# EAGLE design WalkSensor_V2.1 (EAGLE 9.3.0)
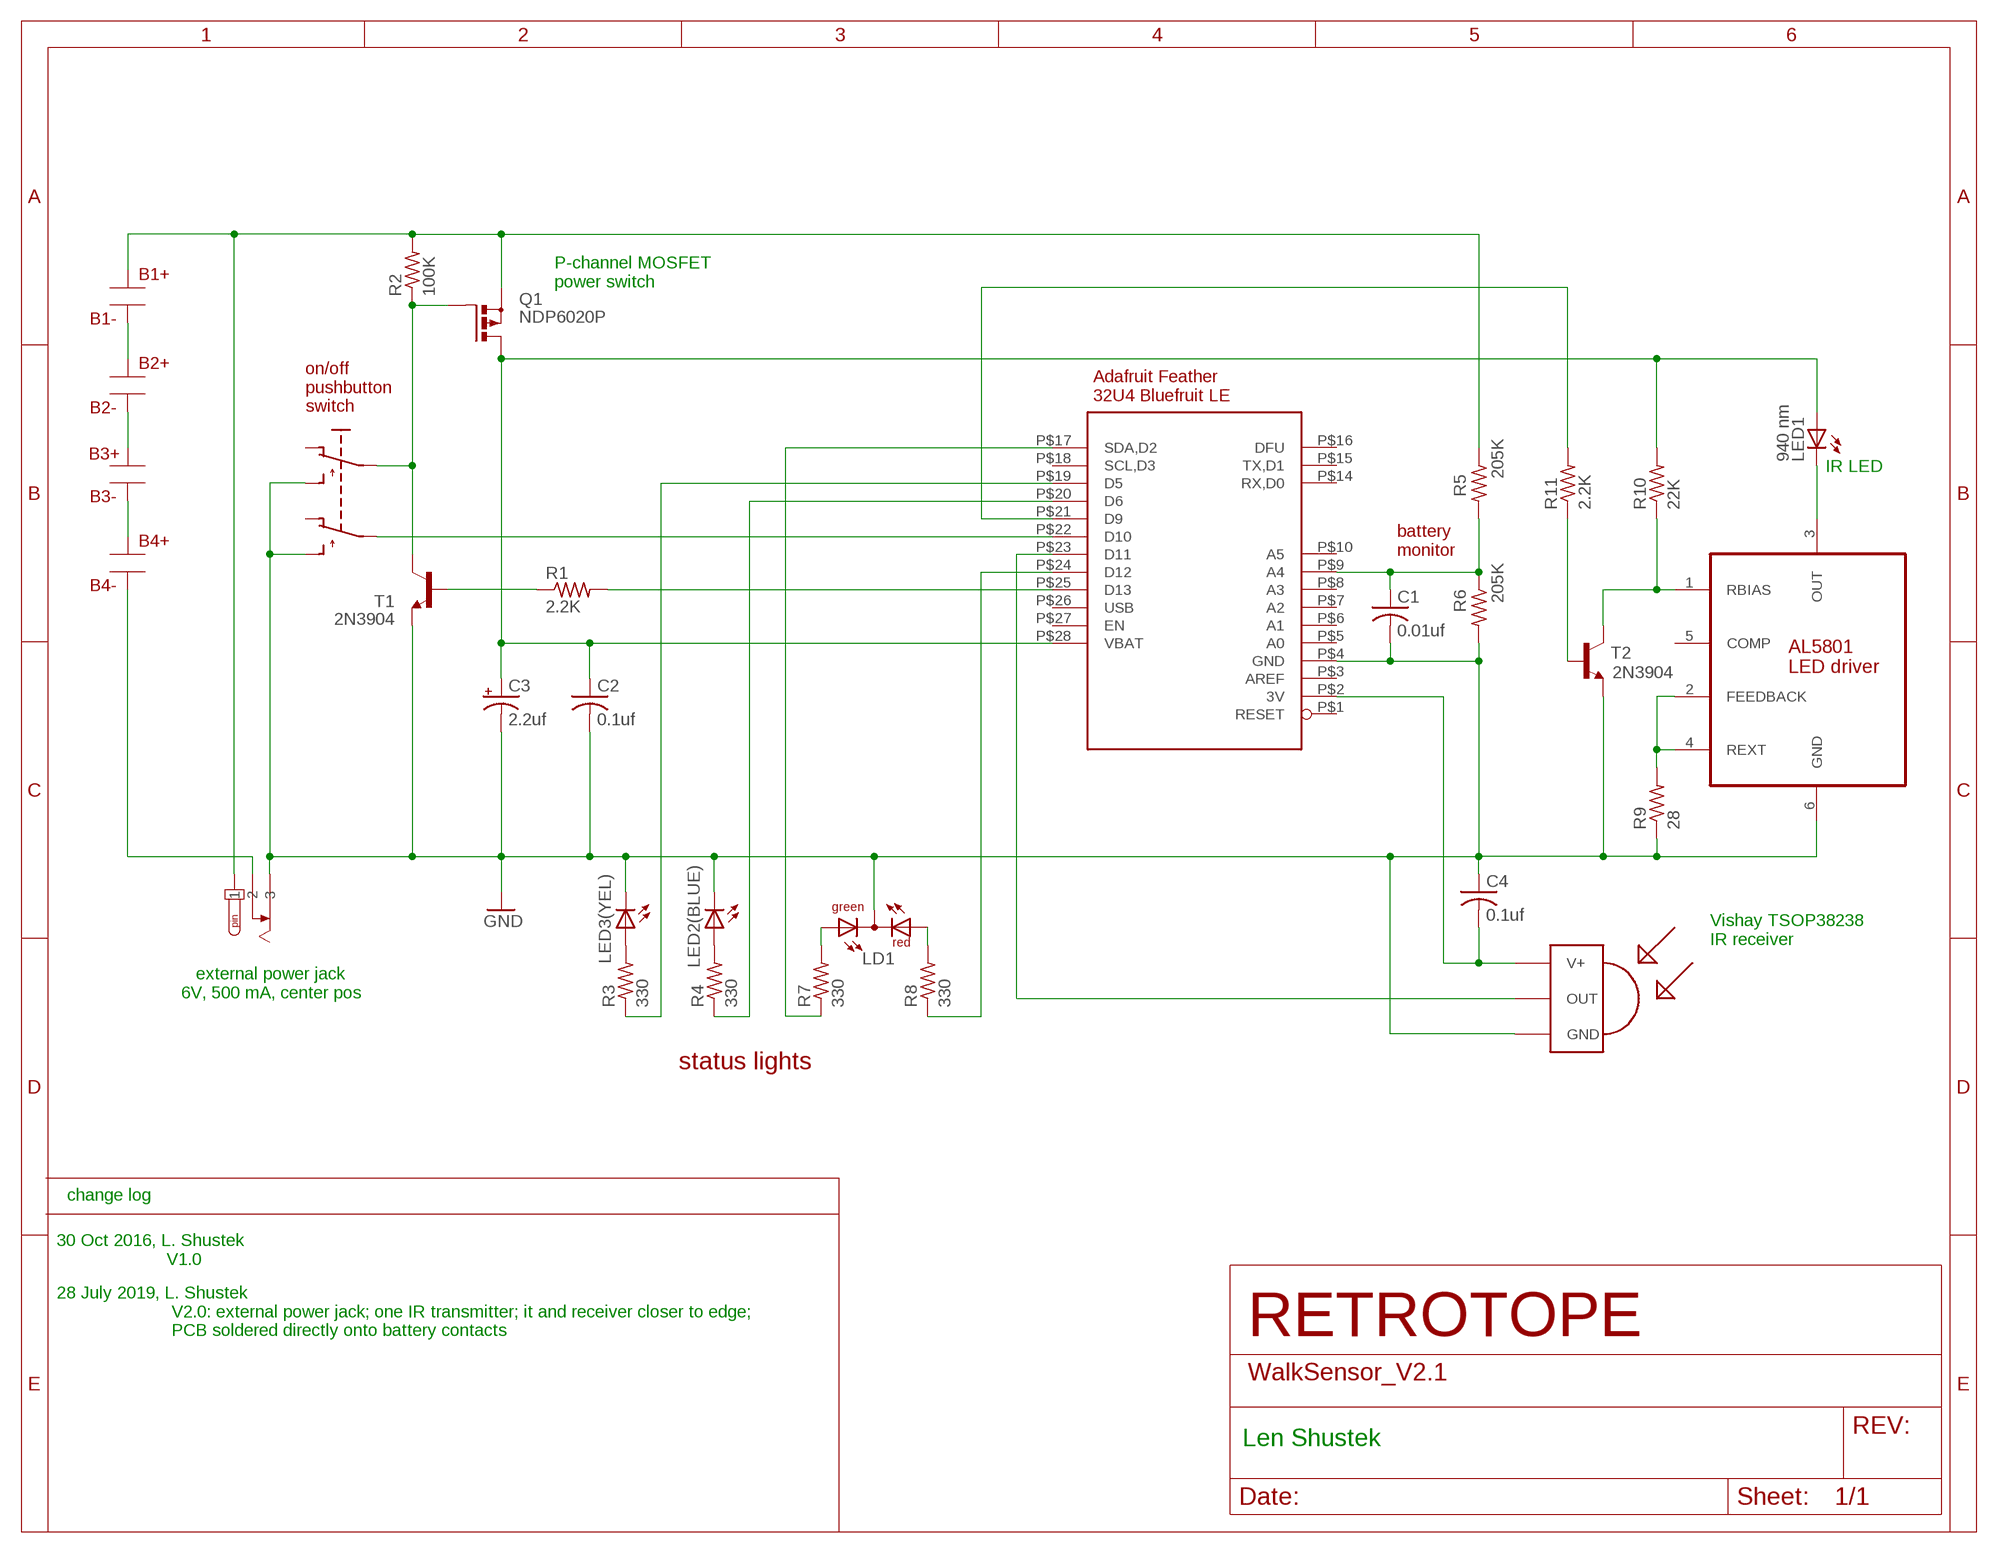
[diagram p0: schematic, sheet 1]

## Parts
B1+  BATTERY_CONTACT  [BATTERY_CONTACT]
B1-  BATTERY_CONTACT  [BATTERY_CONTACT]
B2+  BATTERY_CONTACT  [BATTERY_CONTACT]
B2-  BATTERY_CONTACT  [BATTERY_CONTACT]
B3+  BATTERY_CONTACT  [BATTERY_CONTACT]
B3-  BATTERY_CONTACT  [BATTERY_CONTACT]
B4+  BATTERY_CONTACT  [BATTERY_CONTACT]
B4-  BATTERY_CONTACT  [BATTERY_CONTACT]
C1  0.01uf  C-US025-025X050  [C025-025X050]
C2  0.1uf  C-US025-025X050  [C025-025X050]
C3  2.2uf  CPOL-USE5-6  [E5-6]
C4  0.1uf  C-US025-025X050  [C025-025X050]
J1  DC_POWER_JACK  [DC_POWER_JACK]
LD1  red/green  DUOLED-RG-C  [DUOLED-C-5MM]
LED1  940 nm  LED3MM  [LED3MM]
LED2(BLUE)  blue  LED5MM  [LED5MM]
LED3(YEL)  yellow  LED5MM  [LED5MM]
Q1  NDP6020P  PMOSFET_PTO220BH  [TO220BH]
R1  2.2K  R-US_0207/10  [0207/10]
R2  100K  R-US_0207/10  [0207/10]
R3  330  R-US_0207/10  [0207/10]
R4  330  R-US_0207/10  [0207/10]
R5  205K  R-US_0207/10  [0207/10]
R6  205K  R-US_0207/10  [0207/10]
R7  330  R-US_0207/10  [0207/10]
R8  330  R-US_0207/10  [0207/10]
R9  28  R-US_0207/10  [0207/10]
R10  22K  R-US_0207/10  [0207/10]
R11  2.2K  R-US_0207/10  [0207/10]
T1  2N3904  NPN-TRANSISTOR  [TO92-EBC]
T2  2N3904  NPN-TRANSISTOR  [TO92-EBC]
U1  AL5801  [SOT95P280X130-6N]
U$2  PUSHBUTTON-DPDT  [PUSHBUTTON-DPDT]
U$3  TSOP1830  [TSOP18XX]
U$4  BLUEFRUIT-LE  [BLUEFRUIT-LE]

## Nets
3V [power]: C4.2 U$3.VCC(V+) U$4.P$2(3V)
GND [power]: C1.2 C2.2 C3.- C4.1 J1.P$5 LD1.C LED2(BLUE).K(C) LED3(YEL).K(C) R6.2 R9.1 T1.E T2.E U1.6(GND) U$2.P$1(S) U$2.P$2(S1) U$3.GND U$4.P$4(GND)
N$1: U$2.P$6(P1) U$4.P$22(D10)
N$2: LED3(YEL).A R3.2
N$3 [power]: B1+.P$1 J1.P$1 Q1.S R2.2 R5.1
N$4: LED2(BLUE).A R4.2
N$5: Q1.G R2.1 T1.C U$2.P$5(P)
N$6: R11.1 T2.B
N$7: R1.2 U$4.P$25(D13)
N$8: R1.1 T1.B
N$9: R4.1 U$4.P$20(D6)
N$10: R3.1 U$4.P$19(D5)
N$11 [low power]: LED1.K(C) U1.3(OUT)
N$12: R11.2 U$4.P$21(D9)
N$13: LD1.AG R7.2
N$14: LD1.AR R8.2
N$15 [power]: B1-.P$1 B2+.P$1
N$16: R7.1 U$4.P$17(SDA,D2)
N$17 [power]: B2-.P$1 B3+.P$1
N$18: U$3.OUT U$4.P$23(D11)
N$19: R9.2 U1.2(FEEDBACK) U1.4(REXT)
N$20: C1.1 R5.2 R6.1 U$4.P$9(A4)
N$21: R10.1 T2.C U1.1(RBIAS)
N$22: R8.1 U$4.P$24(D12)
N$23 [power]: B3-.P$1 B4+.P$1
N$24 [power]: B4-.P$1 J1.P$3
VBAT [power]: C2.1 C3.+ LED1.A Q1.D R10.2 U$4.P$28(VBAT)
Unconnected: U1.5(COMP) U$2.P$3(O) U$2.P$4(O1) U$4.P$1(RESET) U$4.P$3(AREF) U$4.P$5(A0) U$4.P$6(A1) U$4.P$7(A2) U$4.P$8(A3) U$4.P$10(A5) U$4.P$14(RX,D0) U$4.P$15(TX,D1) U$4.P$16(DFU) U$4.P$18(SCL,D3) U$4.P$26(USB) U$4.P$27(EN)

## Notes on the sheet
- P-channel MOSFET
  power switch
- Adafruit Feather
  32U4 Bluefruit LE
- on/off
  pushbutton
  switch
- IR LED
- battery
  monitor
- Vishay TSOP38238
  IR receiver
- external power jack
  6V, 500 mA, center pos
- status lights
- change log
- 30 Oct 2016, L. Shustek
                        V1.0
- 28 July 2019, L. Shustek
                         V2.0: external power jack; one IR transmitter; it and receiver closer to edge;
                         PCB soldered directly onto battery contacts
- RETROTOPE
- Len Shustek

## Library data of the parts
B1+ B1- B2+ B2- B3+ B3- B4+ B4- = Len:BATTERY_CONTACT
C1 C2 C4 = resistor:C-US: CAPACITOR, American symbol
C3 = resistor:CPOL-US: POLARIZED CAPACITOR, American symbol
J1 = Len:DC_POWER_JACK: DC POWER JACK Source: DCJ0202.pdf; OC_FARNELL: unknown; OC_NEWARK: unknown
LD1 = Len:DUOLED-RG-C: DUO LED 2 colors (red/green), 5 mm, round, common Cathode www.ligitek.com or other producers.
LED1 = adafruit:LED: LED OSRAM: - CHIPLED LG R971, LG N971, LY N971, LG Q971, LY Q971, LO R971, LY R971 LH N974, LH R974 LS Q976, LO Q976, LY Q976 LO Q996 - Hyper CHIPLED LW Q18S LB Q993, LB Q99A, LB R99A - SideLED LS A670, LO A670, LY A670, LG A670, LP A670 LB A673, LV A673, LT A673, LW A673 LH A674 LY A675 LS A676, LA A676, LO A676, LY A676, LW A676 LS A679, LY A679, LG A679 - Hyper Micro SIDELED® LS Y876, LA Y876, LO Y876, LY Y876 LT Y87S - SmartLED LW L88C, LW L88S LB L89C, LB L89S, LG L890 LS L89K, LO L89K, LY L89K LS L896, LA L896, LO L896, LY L896 - TOPLED LS T670, LO T670, LY T670, LG T670, LP T670 LSG T670, LSP T670, LSY T670, LOP T670, LYG T670 LG T671, LOG T671, LSG T671 LB T673, LV T673, LT T673, LW T673 LH T674 LS T676, LA T676, LO T676, LY T676, LB T676, LH T676, LSB T676, LW T676 LB T67C, LV T67C, LT T67C, LS T67K, LO T67K, LY T67K, LW E67C LS E67B, LA E67B, LO E67B, LY E67B, LB E67C, LV E67C, LT E67C LW T67C LS T679, LY T679, LG T679 LS T770, LO T770, LY T770, LG T770, LP T770 LB T773, LV T773, LT T773, LW T773 LH T774 LS E675, LA E675, LY E675, LS T675 LS T776, LA T776, LO T776, LY T776, LB T776 LHGB T686 LT T68C, LB T68C - Hyper Mini TOPLED® LB M676 - Mini TOPLED Santana® LG M470 LS M47K, LO M47K, LY M47K Source: http://www.osram.convergy.de/
LED2(BLUE) LED3(YEL) = Len:LED: LED OSRAM: - CHIPLED LG R971, LG N971, LY N971, LG Q971, LY Q971, LO R971, LY R971 LH N974, LH R974 LS Q976, LO Q976, LY Q976 LO Q996 - Hyper CHIPLED LW Q18S LB Q993, LB Q99A, LB R99A - SideLED LS A670, LO A670, LY A670, LG A670, LP A670 LB A673, LV A673, LT A673, LW A673 LH A674 LY A675 LS A676, LA A676, LO A676, LY A676, LW A676 LS A679, LY A679, LG A679 - Hyper Micro SIDELED® LS Y876, LA Y876, LO Y876, LY Y876 LT Y87S - SmartLED LW L88C, LW L88S LB L89C, LB L89S, LG L890 LS L89K, LO L89K, LY L89K LS L896, LA L896, LO L896, LY L896 - TOPLED LS T670, LO T670, LY T670, LG T670, LP T670 LSG T670, LSP T670, LSY T670, LOP T670, LYG T670 LG T671, LOG T671, LSG T671 LB T673, LV T673, LT T673, LW T673 LH T674 LS T676, LA T676, LO T676, LY T676, LB T676, LH T676, LSB T676, LW T676 LB T67C, LV T67C, LT T67C, LS T67K, LO T67K, LY T67K, LW E67C LS E67B, LA E67B, LO E67B, LY E67B, LB E67C, LV E67C, LT E67C LW T67C LS T679, LY T679, LG T679 LS T770, LO T770, LY T770, LG T770, LP T770 LB T773, LV T773, LT T773, LW T773 LH T774 LS E675, LA E675, LY E675, LS T675 LS T776, LA T776, LO T776, LY T776, LB T776 LHGB T686 LT T68C, LB T68C - Hyper Mini TOPLED® LB M676 - Mini TOPLED Santana® LG M470 LS M47K, LO M47K, LY M47K Source: http://www.osram.convergy.de/
Q1 = transistor-power:PMOSFET_P: Power MOSFET P-Channel
R1-R11 = resistor:R-US_: RESISTOR, American symbol
T1 T2 = Len:NPN-TRANSISTOR
U1 = Len:AL5801: 25V 10A GATE DRIVER IN SOT26; MPN: ZXGD3005E6TA; OC_FARNELL: 1904033; OC_NEWARK: 55T4050; PACKAGE: SOT-26-6; SUPPLIER: DIODES INC.
U$2 = Len:PUSHBUTTON-DPDT
U$3 = tsop:TSOP1830: IR Receiver and Demodulator
U$4 = Len:BLUEFRUIT-LE

## Net classes
1 power: width 1.27 mm
2 ground: width 1.27 mm
3 low power: width 0.559 mm

## Board
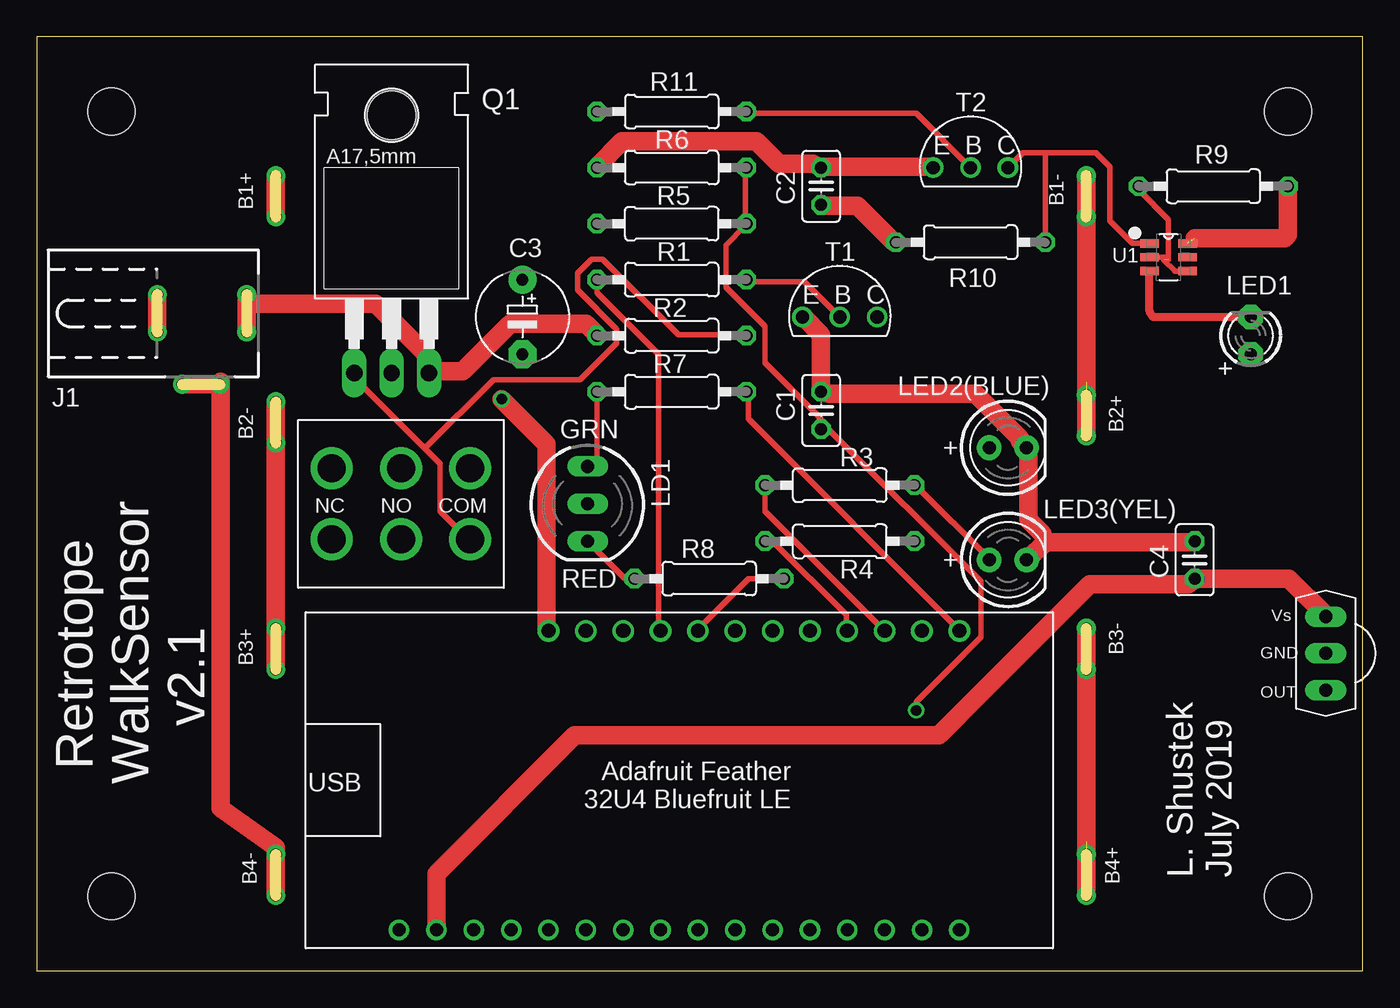
[diagram p1: board, top side]
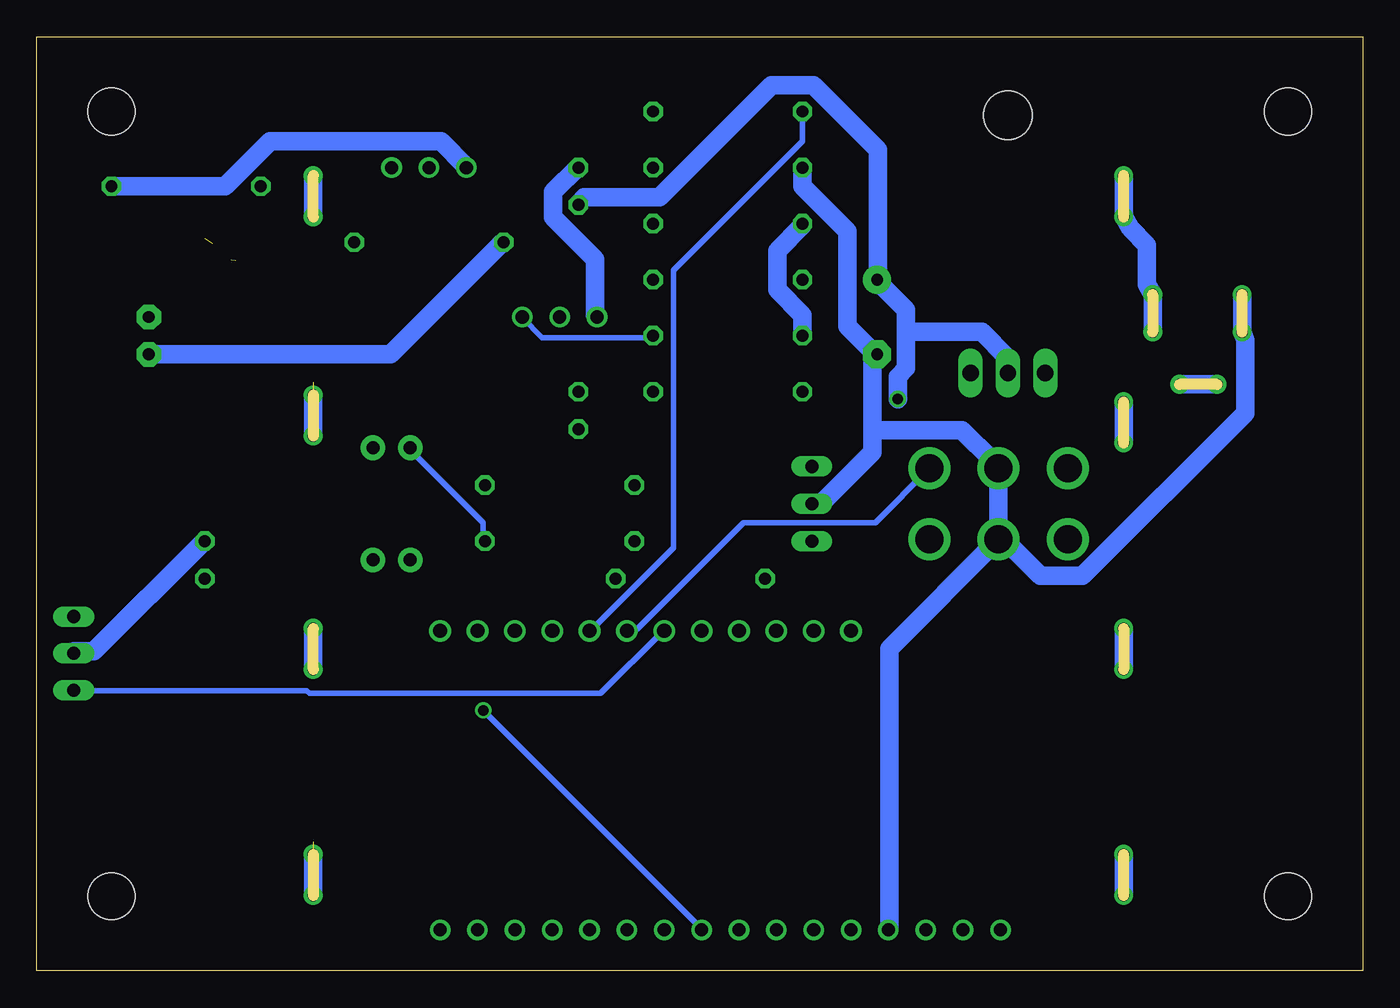
[diagram p2: board, bottom side, seen from below]

Size 90.17 x 63.5 mm. Coordinates in mm from the lower left corner, seen from the top.
Outline: 0,0 90.17,0 90.17,63.5 0,63.5 0,0
Copper layers (1*16): Top 0.035mm / dielectric 1.5mm / Bottom 0.035mm
Design rules "default *": minimum track width 15mil, minimum drill 28mil, track to track 15mil, track to pad 15mil, pad to pad 15mil, via to via 15mil, smd to smd 15mil, copper to edge 40mil, drill to drill 8mil, minimum pad ring 10mil, minimum via ring 8mil, stop-mask expansion 4mil, vias tented up to drill 0mil, thermal gap 10mil
Holes 3.17 mm at 85.09,58.42 85.09,5.08 5.08,5.08 5.08,58.42

### Footprints (pad centres in the part's own frame; a part is rotated, then mirrored left to right if it is on the bottom)
BATTERY_CONTACT = drill 0.762: P$1 -1.397,0; P$2 1.397,0
C025-025X050 = drill 0.813 octagon: 1 -1.27,0; 2 1.27,0
E5-6 = drill 0.813 pad 1.905: + -2.54,0 | drill 0.813 pad 1.905 octagon: - 2.54,0
DC_POWER_JACK = drill 0.762: P$1 -1.27,3.099; P$2 1.27,3.099; P$3 4.826,-1.27; P$4 4.826,1.27; P$5 1.27,-2.972; P$6 -1.27,-2.972
DUOLED-C-5MM = drill 0.889 long: AG -2.54,0; AR 2.54,0; C 0,0
LED3MM = drill 0.813 pad 1.676 octagon: A -1.27,0; K 1.27,0
LED5MM = drill 0.889 pad 1.676: A -1.27,0; K 1.27,0
TO220BH = drill 1.118 long: D 0,-6.35; G -2.54,-6.35; S 2.54,-6.35 | hole 3.302: 0,11.176
0207/10 = drill 0.813 octagon: 1 -5.08,0; 2 5.08,0
TO92-EBC = drill 0.889: B 0,-1.27; C 2.54,-1.27; E -2.54,-1.27
SOT95P280X130-6N = smd 1.27 x 0.559: 1 -1.295,0.94; 2 -1.295,0; 3 -1.295,-0.94; 4 1.295,-0.94; 5 1.295,0; 6 1.295,0.94
PUSHBUTTON-DPDT = drill 1.905: P$1 -2.413,0; P$2 2.413,0; P$3 -2.413,4.699; P$4 2.413,4.699; P$5 -2.413,-4.699; P$6 2.413,-4.699
TSOP18XX = drill 0.889 long: GND -0.001,-0.027; OUT -2.501,-0.027; VCC 2.499,-0.027
BLUEFRUIT-LE = drill 0.889: P$1 19.05,10.16; P$2 16.51,10.16; P$3 13.97,10.16; P$4 11.43,10.16; P$5 8.89,10.16; P$6 6.35,10.16; P$7 3.81,10.16; P$8 1.27,10.16; P$9 -1.27,10.16; P$10 -3.81,10.16; P$11 -6.35,10.16; P$12 -8.89,10.16; P$13 -11.43,10.16; P$14 -13.97,10.16; P$15 -16.51,10.16; P$16 -19.05,10.16 | drill 0.965: P$17 -19.05,-10.16; P$18 -16.51,-10.16; P$19 -13.97,-10.16; P$20 -11.43,-10.16; P$21 -8.89,-10.16; P$22 -6.35,-10.16; P$23 -3.81,-10.16; P$24 -1.27,-10.16; P$25 1.27,-10.16; P$26 3.81,-10.16; P$27 6.35,-10.16; P$28 8.89,-10.16

### Placement (x,y rotation side)
B1+  16.26,52.66 90 top
B1-  71.37,52.66 90 top
B2+  71.37,37.75 270 top
B2-  16.26,37.29 90 top
B3+  16.26,21.89 270 top
B3-  71.37,21.89 90 top
B4+  71.37,6.53 270 top
B4-  16.26,6.53 90 top
C1  53.34,38.1 90 top
C2  53.34,53.34 90 top
C3  33.02,44.45 270 top
C4  78.74,27.94 270 top
J1  11.18,44.7 270 top
LD1  37.47,31.75 270 top
LED1  82.55,43.18 90 top
LED2(BLUE)  66.04,35.56 0 top
LED3(YEL)  66.04,27.94 0 top
Q1  24.13,46.99 0 top
R1  43.18,46.99 180 top
R2  43.18,43.18 180 top
R3  54.61,33.02 0 top
R4  54.61,29.21 0 top
R5  43.18,50.8 0 top
R6  43.18,54.61 180 top
R7  43.18,39.37 180 top
R8  45.72,26.67 180 top
R9  80.01,53.34 180 top
R10  63.5,49.53 180 top
R11  43.18,58.42 180 top
T1  54.61,45.72 0 top
T2  63.5,55.88 0 top
U1  76.96,48.51 0 top
U$2  24.77,31.75 90 top
U$3  87.63,21.59 90 top
U$4  43.69,12.95 180 top

### Tracks (layer width: path | path; a pad name or v marks a point on that pad's centre or on a via)
3V
  Top 1.27: U$3.VCC 87.63,24.19 85.15,26.67 C4.2 78.3,26.29 71.63,26.29 61.34,16 36.58,16 27.18,6.6 U$4.P$2
GND  (1 unrouted)
  Top 1.27: 68.58,29.15 78.68,29.15 C4.1 | 68.58,29.15 67.44,28 LED3(YEL).K | 68.58,29.15 68.39,29.72 67.44,30.67 67.44,35.43 LED2(BLUE).K 66.86,36.01 66.86,36.2 63.82,39.24 53.91,39.24 C1.2 53.34,43.24 52.2,44.39 T1.E | T2.E 60.96,54.67 53.34,54.67 C2.2 52.77,54.86 50.48,54.86 48.96,56.39 39.81,56.39 38.1,54.67 R6.2 | R9.1 85.09,50.04 84.86,49.81 78.74,49.81
  Bottom 1.27: U$3.GND 87.63,21.72 86.3,21.72 78.87,29.15 C4.1 | R9.1 77.34,53.34 74.3,56.39 62.67,56.39 60.96,54.67 T2.E | T1.E 52.2,44.58 52.2,48.39 55.05,51.24 55.05,52.96 53.34,54.67 C2.2 | R6.2 38.1,53.34 35.05,50.29 35.05,43.81 33.15,41.91 C3.- 33.34,41.34 33.34,36.77 | 33.34,36.77 33.34,35.24 36.77,31.81 37.34,31.81 LD1.C | U$2.P$1 32.19,21.91 32.19,2.86 U$4.P$4 | J1.P$5 8,42.86 8,37.91 19.05,26.86 21.91,26.86 24.19,29.15 U$2.P$1 | U$2.P$1 U$2.P$2 25.15,34.67 27.24,36.77 33.34,36.77
N$1
  Bottom 0.381: U$2.P$6 33.15,30.48 42.1,30.48 49.34,23.24 49.91,23.24 U$4.P$22
N$2
  Top 0.381: R3.2 59.82,32.96 64.77,28 LED3(YEL).A
N$3  (1 unrouted)
  Top 1.27: R2.2 38.1,43.24 37.34,44.01 32.19,44.01 28.96,40.77 26.67,40.77 Q1.S 26.48,41.34 26.48,41.91 23.05,45.34 14.53,45.34 J1.P$1
  Bottom 1.27: J1.P$1 14.67,46.67 14.67,49.34 15.81,50.48 B1+.P$1 | R2.2 38.1,44.58 39.81,46.29 39.81,48.96 38.1,50.67 R5.1
N$4
  Bottom 0.381: R4.2 59.82,29.34 59.82,30.48 64.77,35.43 LED2(BLUE).A
N$5
  Top 0.381: 26.38,35.53 27.43,34.48 27.43,31.24 29.34,29.34 U$2.P$5 | 26.38,35.53 21.72,40.2 21.72,40.58 Q1.G | 26.38,35.53 31.05,40.2 36.96,40.2 39.43,42.67 39.43,43.62 36.77,46.29 36.77,47.43 37.72,48.39 38.48,48.39 43.62,43.24 48.2,43.24 R2.1
  Bottom 0.381: R2.1 48.39,43.05 55.82,43.05 57.15,44.39 T1.C
N$6
  Top 0.381: T2.B 59.82,58.29 48.39,58.29 R11.1
N$7
  Top 0.381: R1.2 38.1,46.1 42.29,41.91 42.29,23.24 U$4.P$25
N$8
  Top 0.381: T1.B 52.2,46.86 48.39,46.86 R1.1
N$9
  Top 0.381: R4.1 49.53,29.15 50.1,29.15 55.05,24.19 55.05,23.24 U$4.P$20
N$10
  Top 0.381: R3.1 49.53,31.24 U$4.P$19
N$11
  Top 0.559: LED1.K 75.92,44.45 75.67,44.85 U1.3
N$12
  Bottom 0.381: R11.2 38.1,56.39 46.86,47.62 46.86,28.77 52.58,23.05 U$4.P$21
N$13
  Top 0.381: R7.2 38.1,34.86 37.53,34.29 LD1.AG
N$14
  Top 0.381: R8.2 40.01,26.67 LD1.AR
N$15  (1 unrouted)
  Top 1.27: 71.37,36.48 71.37,40.01 71.37,50.48 B1-.P$1
N$16
  Top 0.381: R7.1 48.39,39.24 48.39,37.53 62.67,23.24 U$4.P$17
N$17
  Top 1.27: B3+.P$1 16.26,24 16.26,35.05 B2-.P$1
N$18
  Bottom 0.381: U$3.OUT 87.63,19.05 71.82,19.05 71.63,18.86 51.82,18.86 47.62,23.05 U$4.P$23
N$19  (1 unrouted)
  Top 0.381: U1.4 77.39,47.57 77.38,47.59 76.64,48.32 | U1.2 76.73,48.51 76.96,48.35 76.96,51.05 74.93,53.09 R9.2
N$20  (via drill 0.71)
  Top 0.381: R6.1 48.2,54.48 48.2,50.86 R5.2 48.2,50.67 46.86,49.34 46.86,46.48 49.53,43.81 49.53,41.34 53.34,37.53 C1.1 53.34,36.77 53.91,36.77 64.2,26.48 64.2,22.67 59.82,18.29 v59.82,17.72
  Bottom 0.381: v59.82,17.72 44.96,2.86 U$4.P$9
N$21
  Top 0.381: U1.1 74.5,49.45 72.96,50.99 72.96,54.67 72.01,55.63 68.58,55.63 | 68.58,55.63 67.06,55.63 T2.C | 68.58,55.63 R10.1
N$22
  Top 0.381: R8.1 48.39,26.67 44.96,23.24 U$4.P$24
N$23  (1 unrouted)
  Top 1.27: 71.37,5.26 71.37,8.76 71.37,19.62 B3-.P$1
N$24
  Top 1.27: J1.P$3 12.28,39.88 12.51,40.04 12.51,11.07 16.26,8.42 B4-.P$1
VBAT  (via drill 0.71)
  Top 1.27: v31.62,38.86 34.67,35.81 34.67,23.24 U$4.P$28 | C2.1 53.34,52.01 55.82,52.01 58.29,49.53 R10.2
  Bottom 1.27: v31.62,38.86 31.62,40.39 31.05,40.96 31.05,43.43 | 31.05,43.43 31.05,44.96 32.96,46.86 C3.+ 32.96,47.62 32.96,55.82 37.34,60.2 40.2,60.2 47.82,52.58 52.96,52.58 53.34,52.2 C2.1 | 31.05,43.43 25.91,43.43 24.19,41.72 24.19,40.77 Q1.D | LED1.A 66.1,41.91 58.48,49.53 R10.2

### Text on the board
tPlace: Retrotope / WalkSensor / v2.1 | L. Shustek / July 2019